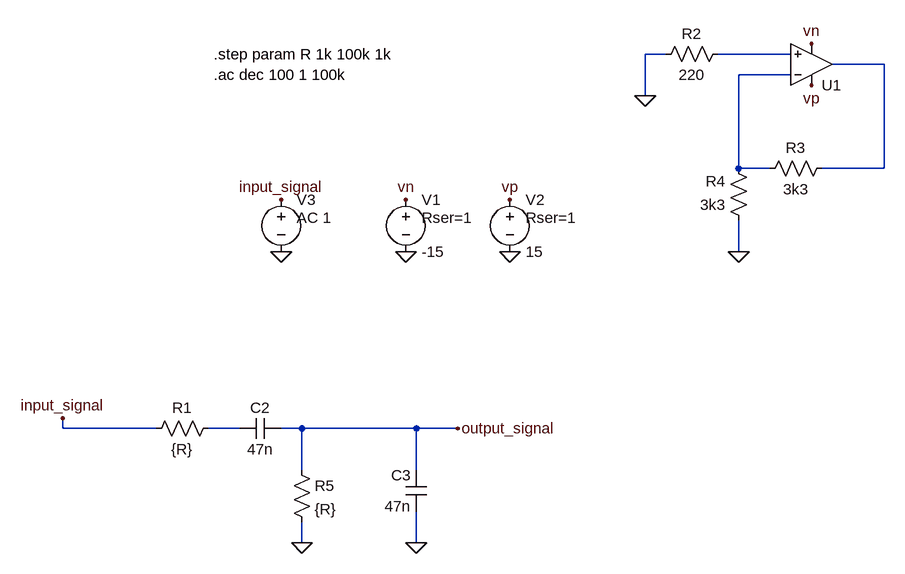
[diagram p0: schematic wien_bridge.asc]
wien_bridge.asc, the LTspice schematic file:
Version 4
SHEET 1 1152 680
WIRE 352 -624 320 -624
WIRE 544 -624 432 -624
WIRE 688 -608 608 -608
WIRE 544 -592 464 -592
WIRE 320 -560 320 -624
WIRE 464 -448 464 -592
WIRE 512 -448 464 -448
WIRE 688 -448 688 -608
WIRE 688 -448 592 -448
WIRE 464 -320 464 -368
WIRE -576 -48 -576 -64
WIRE -432 -48 -576 -48
WIRE -304 -48 -352 -48
WIRE -208 -48 -240 -48
WIRE -32 -48 -208 -48
WIRE 32 -48 -32 -48
WIRE -208 16 -208 -48
WIRE -32 16 -32 -48
WIRE -208 128 -208 96
WIRE -32 128 -32 80
FLAG 464 -320 0
FLAG -208 128 0
FLAG 576 -576 vp
FLAG 112 -400 vp
FLAG 576 -640 vn
FLAG -48 -400 vn
FLAG -48 -320 0
FLAG 112 -320 0
FLAG -240 -400 input_signal
FLAG -576 -64 input_signal
FLAG 32 -48 output_signal
FLAG -240 -320 0
FLAG 320 -560 0
FLAG -32 128 0
SYMBOL res 448 -640 R90
WINDOW 0 0 56 VBottom 2
WINDOW 3 32 56 VTop 2
SYMATTR InstName R2
SYMATTR Value 220
SYMBOL res 608 -464 R90
WINDOW 0 0 56 VBottom 2
WINDOW 3 32 56 VTop 2
SYMATTR InstName R3
SYMATTR Value 3k3
SYMBOL res 480 -352 R180
WINDOW 0 36 76 Left 2
WINDOW 3 36 40 Left 2
SYMATTR InstName R4
SYMATTR Value 3k3
SYMBOL OpAmps\\UniversalOpAmp 576 -608 M180
SYMATTR InstName U1
SYMBOL voltage -48 -416 R0
WINDOW 123 0 0 Left 0
WINDOW 39 24 44 Left 2
SYMATTR SpiceLine Rser=1
SYMATTR InstName V1
SYMATTR Value -15
SYMBOL voltage 112 -416 R0
WINDOW 123 0 0 Left 0
WINDOW 39 24 44 Left 2
SYMATTR SpiceLine Rser=1
SYMATTR InstName V2
SYMATTR Value 15
SYMBOL voltage -240 -416 R0
WINDOW 123 24 44 Left 2
WINDOW 39 0 0 Left 0
SYMATTR Value2 AC 1
SYMATTR InstName V3
SYMATTR Value ""
SYMBOL res -336 -64 R90
WINDOW 0 0 56 VBottom 2
WINDOW 3 32 56 VTop 2
SYMATTR InstName R1
SYMATTR Value {R}
SYMBOL res -224 0 R0
SYMATTR InstName R5
SYMATTR Value {R}
SYMBOL cap -240 -64 R90
WINDOW 0 0 32 VBottom 2
WINDOW 3 32 32 VTop 2
SYMATTR InstName C2
SYMATTR Value 47n
SYMBOL cap -16 80 R180
WINDOW 0 24 56 Left 2
WINDOW 3 24 8 Left 2
SYMATTR InstName C3
SYMATTR Value 47n
TEXT -344 -592 Left 2 !.ac dec 100 1 100k
TEXT -344 -624 Left 2 !.step param R 1k 100k 1k

The netlist it stands for:
* wien_bridge.asc
R2 N001 0 220
R3 N002 N003 3k3
R4 0 N003 3k3
XU1 N001 N003 vp vn N002 level1 Avol=1Meg GBW=10Meg Vos=0 En=0 Enk=0 In=0 Ink=0 Rin=500Meg  ; pins In+ In- V+ V- OUT
V1 vn 0 -15 Rser=1
V2 vp 0 15 Rser=1
V3 input_signal 0 AC 1
R1 N004 input_signal {R}
R5 output_signal 0 {R}
C2 output_signal N004 47n
C3 0 output_signal 47n
.ac dec 100 1 100k
.step param R 1k 100k 1k
.lib UniversalOpAmp1.lib
.backanno
.end